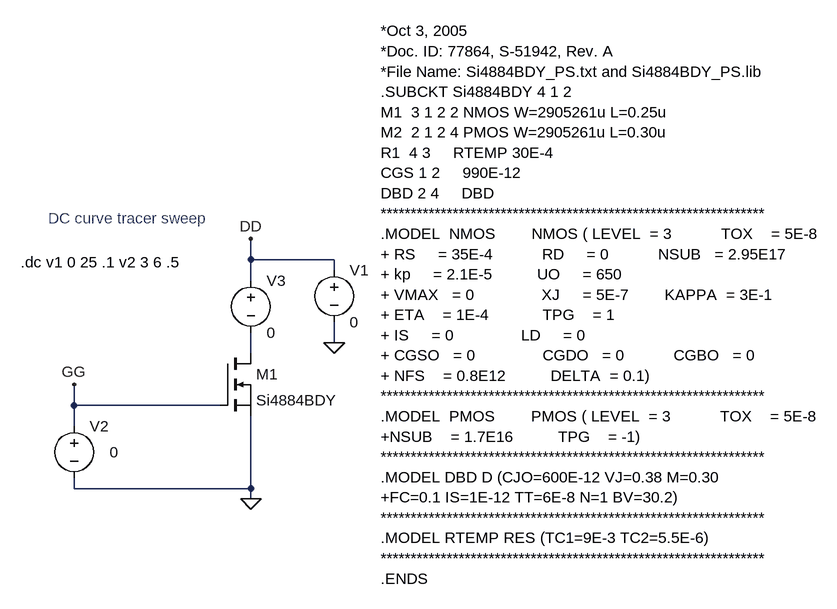
[diagram p0: schematic Si4884BDY.asc]
Si4884BDY.asc, the LTspice schematic file:
Version 4
SHEET 1 1792 2040
WIRE 0 544 0 512
WIRE 0 576 0 544
WIRE 0 672 0 656
WIRE 224 544 0 544
WIRE 272 320 272 288
WIRE 272 352 272 320
WIRE 272 464 272 432
WIRE 272 672 0 672
WIRE 272 672 272 560
WIRE 272 688 272 672
WIRE 400 320 272 320
WIRE 400 336 400 320
WIRE 400 448 400 416
FLAG 272 688 0
FLAG 272 288 DD
FLAG 0 512 GG
FLAG 400 448 0
SYMBOL nmos 224 464 R0
SYMATTR InstName M1
SYMATTR Value Si4884BDY
SYMATTR Prefix X
SYMBOL voltage 0 560 R0
WINDOW 123 0 0 Left 0
WINDOW 39 0 0 Left 0
WINDOW 3 55 56 Left 0
SYMATTR Value 0
SYMATTR InstName V2
SYMBOL voltage 400 320 R0
WINDOW 123 0 0 Left 0
WINDOW 39 0 0 Left 0
SYMATTR InstName V1
SYMATTR Value 0
SYMBOL voltage 272 336 R0
WINDOW 123 0 0 Left 0
WINDOW 39 0 0 Left 0
SYMATTR InstName V3
SYMATTR Value 0
TEXT 472 -32 Left 0 !*Oct 3, 2005\n*Doc. ID: 77864, S-51942, Rev. A\n*File Name: Si4884BDY_PS.txt and Si4884BDY_PS.lib\n.SUBCKT Si4884BDY 4 1 2\nM1  3 1 2 2 NMOS W=2905261u L=0.25u   \nM2  2 1 2 4 PMOS W=2905261u L=0.30u   \nR1  4 3     RTEMP 30E-4\nCGS 1 2     990E-12\nDBD 2 4     DBD\n**************************************************************** \n.MODEL  NMOS        NMOS ( LEVEL  = 3           TOX    = 5E-8\n+ RS     = 35E-4           RD     = 0           NSUB   = 2.95E17   \n+ kp     = 2.1E-5          UO     = 650             \n+ VMAX   = 0               XJ     = 5E-7        KAPPA  = 3E-1\n+ ETA    = 1E-4            TPG    = 1  \n+ IS     = 0               LD     = 0                             \n+ CGSO   = 0               CGDO   = 0           CGBO   = 0 \n+ NFS    = 0.8E12          DELTA  = 0.1)\n**************************************************************** \n.MODEL  PMOS        PMOS ( LEVEL  = 3           TOX    = 5E-8\n+NSUB    = 1.7E16          TPG    = -1)   \n**************************************************************** \n.MODEL DBD D (CJO=600E-12 VJ=0.38 M=0.30 \n+FC=0.1 IS=1E-12 TT=6E-8 N=1 BV=30.2)\n**************************************************************** \n.MODEL RTEMP RES (TC1=9E-3 TC2=5.5E-6)\n**************************************************************** \n.ENDS
TEXT -82 324 Left 0 !.dc v1 0 25 .1 v2 3 6 .5
TEXT -40 256 Left 0 ;DC curve tracer sweep

The netlist it stands for:
* Si4884BDY.asc
XM1 N001 GG 0 Si4884BDY  ; pins D G S
V2 GG 0 0
V1 DD 0 0
V3 DD N001 0
*Oct 3, 2005
*Doc. ID: 77864, S-51942, Rev. A
*File Name: Si4884BDY_PS.txt and Si4884BDY_PS.lib
.SUBCKT Si4884BDY 4 1 2
M1  3 1 2 2 NMOS W=2905261u L=0.25u
M2  2 1 2 4 PMOS W=2905261u L=0.30u
R1  4 3     RTEMP 30E-4
CGS 1 2     990E-12
DBD 2 4     DBD
****************************************************************
.MODEL  NMOS        NMOS ( LEVEL  = 3           TOX    = 5E-8
+ RS     = 35E-4           RD     = 0           NSUB   = 2.95E17
+ kp     = 2.1E-5          UO     = 650
+ VMAX   = 0               XJ     = 5E-7        KAPPA  = 3E-1
+ ETA    = 1E-4            TPG    = 1
+ IS     = 0               LD     = 0
+ CGSO   = 0               CGDO   = 0           CGBO   = 0
+ NFS    = 0.8E12          DELTA  = 0.1)
****************************************************************
.MODEL  PMOS        PMOS ( LEVEL  = 3           TOX    = 5E-8
+NSUB    = 1.7E16          TPG    = -1)
****************************************************************
.MODEL DBD D (CJO=600E-12 VJ=0.38 M=0.30
+FC=0.1 IS=1E-12 TT=6E-8 N=1 BV=30.2)
****************************************************************
.MODEL RTEMP RES (TC1=9E-3 TC2=5.5E-6)
****************************************************************
.ENDS
.dc v1 0 25 .1 v2 3 6 .5
* DC curve tracer sweep
.backanno
.end